# Altium schematic sheet MainAurdino.SchDoc
size 420 x 297 mm; SheetNumber: 1; SheetTotal: 1
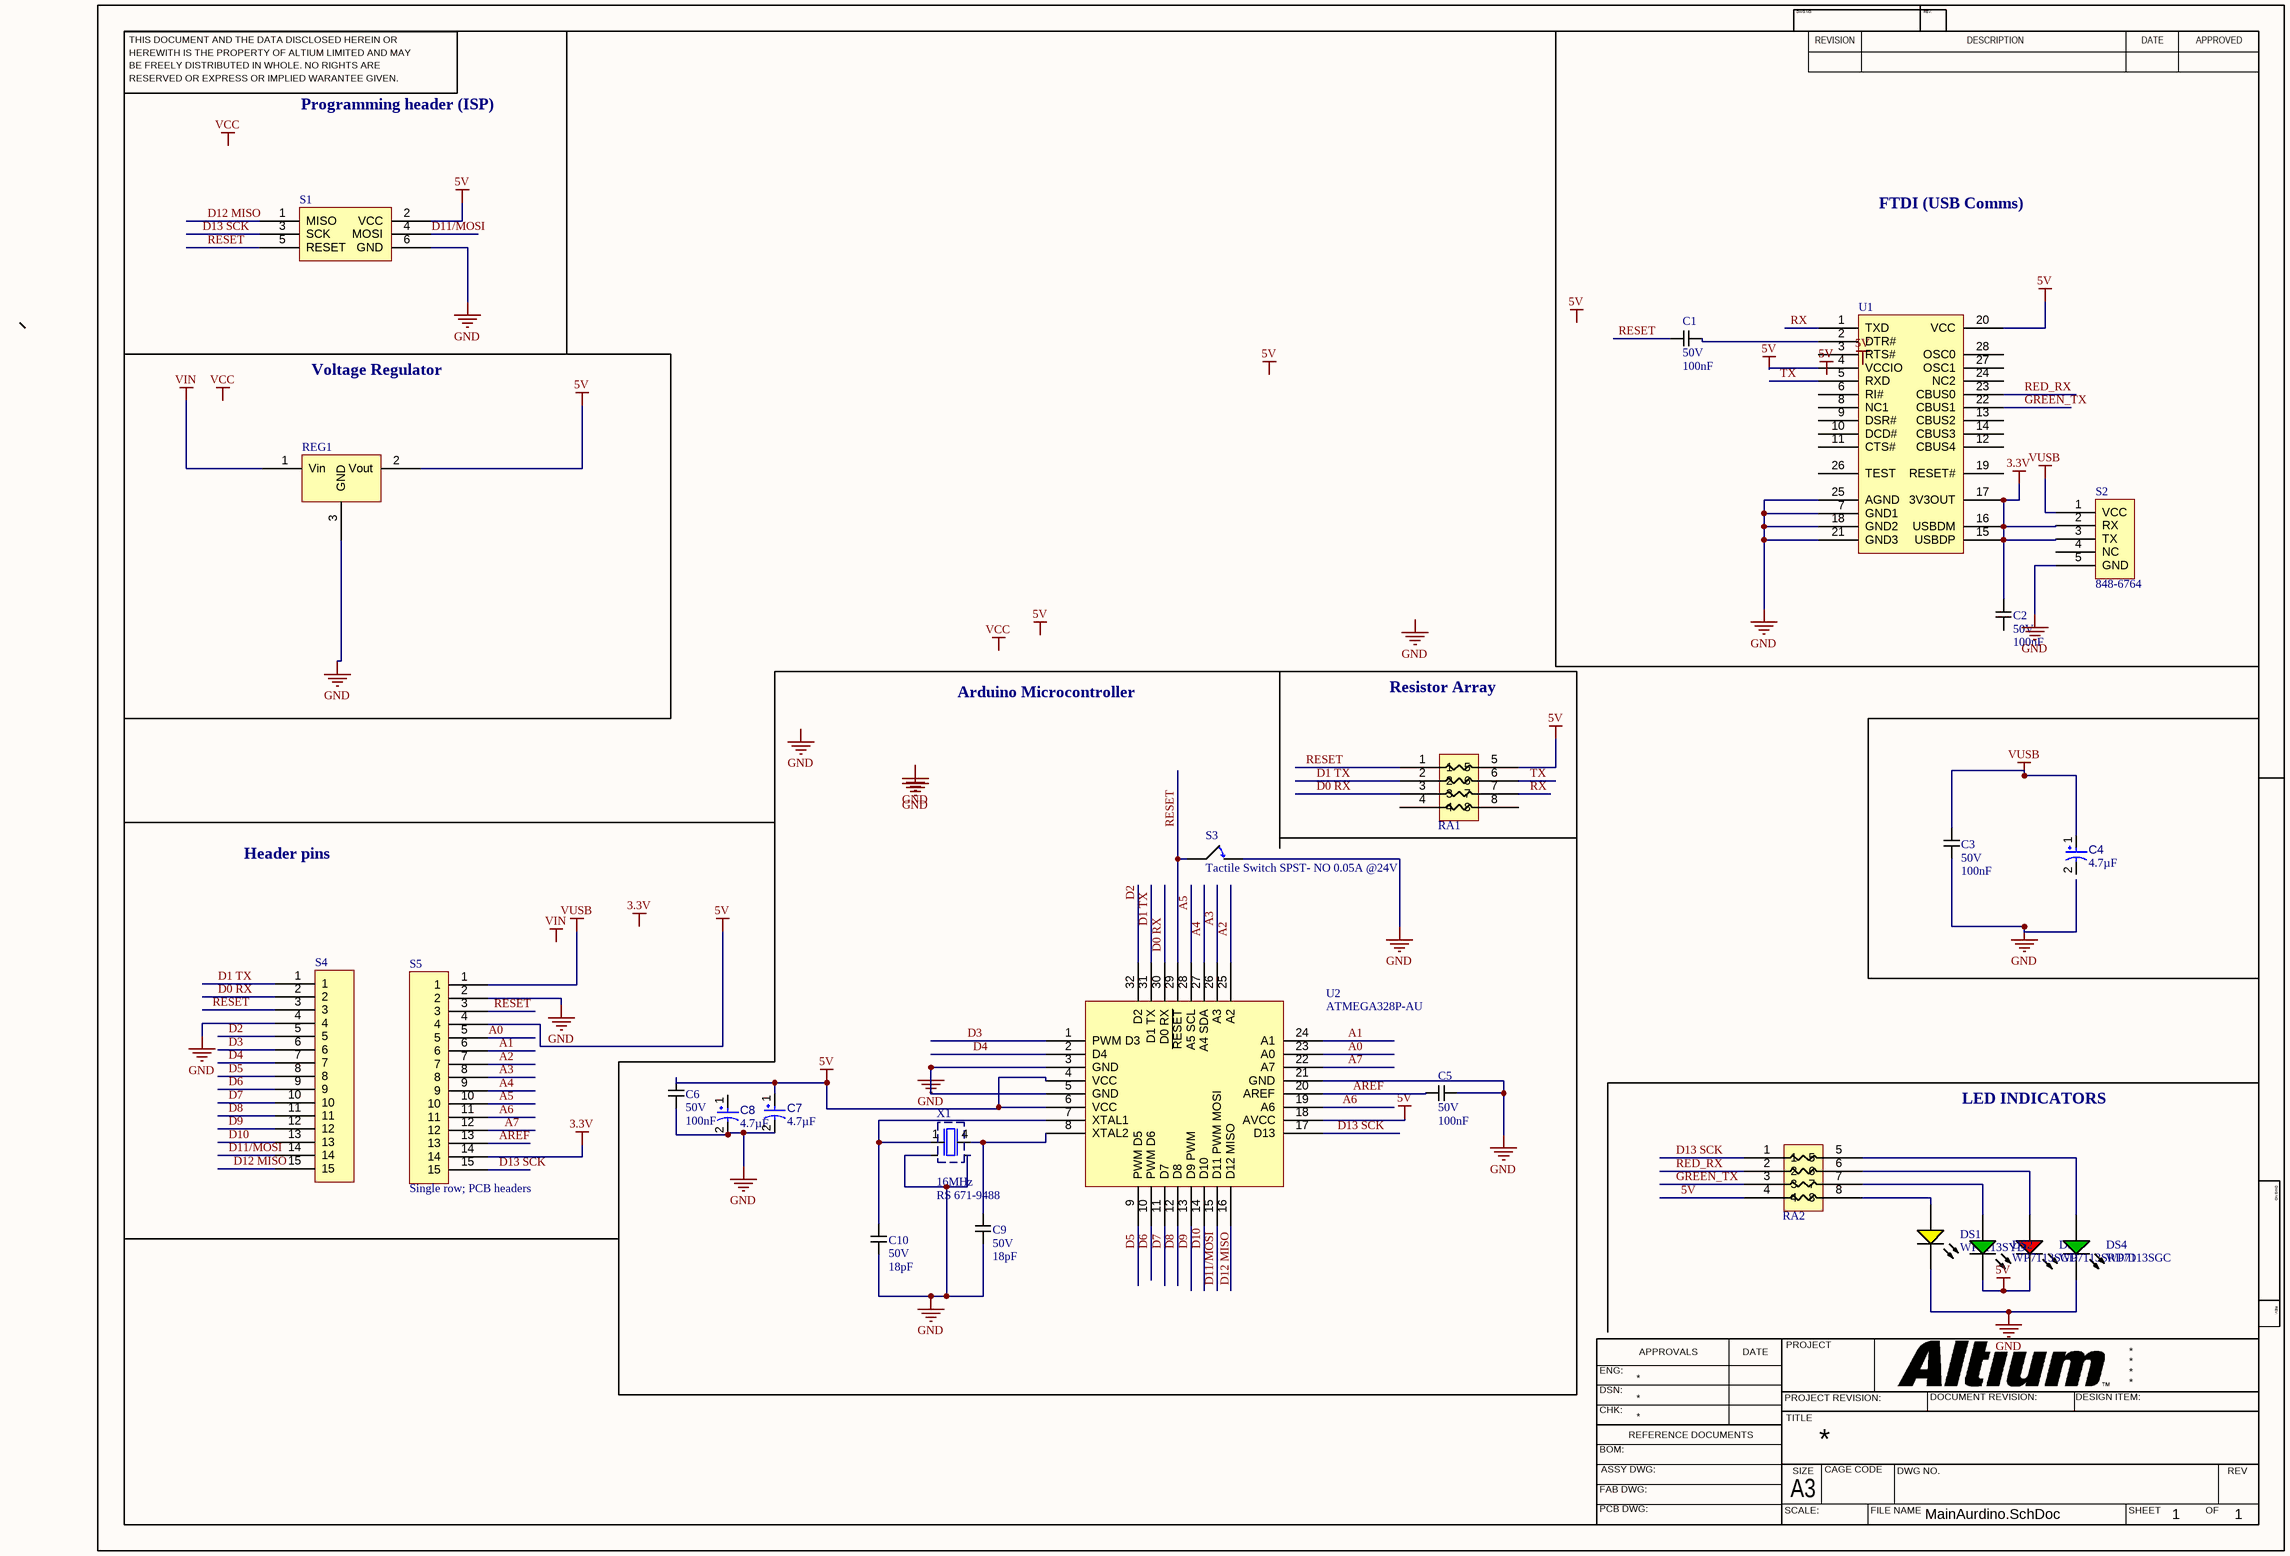
[diagram p0: MainAurdino.SchDoc]

## Parts
C1  Voltage: 50V  Capacitance: 100nF  [CAPCP2012X09N]  (hidden comment: 100nF Ceramic Multilayer Capacitor_1)
C2  Voltage: 50V  Capacitance: 100nF  [CAPCP2012X09N]  (hidden comment: 100nF Ceramic Multilayer Capacitor_1)
C3  Voltage: 50V  Capacitance: 100nF  [CAPCP2012X09N]  (hidden comment: 100nF Ceramic Multilayer Capacitor_1)
C4  value 4.7µF  [AVX-TAJ-A-2_L]  (hidden comment: TAJA475K016RNJ)
C5  Voltage: 50V  Capacitance: 100nF  [CAPCP2012X09N]  (hidden comment: 100nF Ceramic Multilayer Capacitor_1)
C6  Voltage: 50V  Capacitance: 100nF  [CAPCP2012X09N]  (hidden comment: 100nF Ceramic Multilayer Capacitor_1)
C7  value 4.7µF  [AVX-TAJ-A-2_L]  (hidden comment: TAJA475K016RNJ)
C8  value 4.7µF  [AVX-TAJ-A-2_L]  (hidden comment: TAJA475K016RNJ)
C9  Voltage: 50V  Capacitance: 18pF  [CAPCP2012X09N]  (hidden comment: 100nF Ceramic Multilayer Capacitor_1)
C10  Voltage: 50V  Capacitance: 18pF  [CAPCP2012X09N]  (hidden comment: 100nF Ceramic Multilayer Capacitor_1)
DS1  WP7113SYD  [KING-WP7113SYD_V]
DS2  WP7113SGD  [KING-WP7113SGD_V]
DS3  WP7113SRD/D  [KING-WP7113SRDD_V]
DS4  WP7113SGC  [KING-WP7113SGC_V]
RA1  1k +- 5% SMT Resistor Array  [1206 RA]  (value not drawn)
RA2  680 +- 5% SMT Resistor Array 4 Res 1206  [1206 RA]  (value not drawn)
REG1  LM1117MP-5.0  [SOT230P700X180-4N]  (value not drawn)
S1  Programming ISP, Programming Headers Dual Row  [ISP HEADER]  (value not drawn)
S2  RS Stock No: 848-6764  [MicroUSB]  (hidden comment: Micro USB Connector, 30 V ac, 1.8A)
S3  Tactile Switch SPST- NO 0.05A @24V  [Tactile Switch]
S4  Single row; PCB headers  [Header]  (value not drawn)
S5  Single row; PCB headers  [Header]
U1  FT232RL USB to UART, Universal Asynchronous Receiver & Transmitter 3MBd, 28-Pin, SSOP  [SOP65P780X200-28N]  (value not drawn)
U2  ATMEGA328P-AU  [TQFP80P900X900X120-32N]
X1  value 16MHz  RS: RS 671-9488  [Aker S5C Crystal]  (hidden comment: Aker  C5S-16.000-12-3030-X)

## Nets
3.3V: C2.2 S2.2(RX) S2.3(TX) S5.14 U1.15(USBDP) U1.16(USBDM) U1.17(3V3OUT)
5V: C6.2 C7.1 DS2.2(K) DS3.2(K) RA1.5 RA2.4 REG1.2(Vout) S1.2(VCC) S5.4 U1.4(VCCIO) U1.20(VCC) U2.4(VCC) U2.6(VCC) U2.18(AVCC)
GND: C3.1 C5.2 C6.1 C7.2 C8.2 C9.1 C10.1 DS1.2(K) DS4.2(K) REG1.3(GND) S1.6(GND) S2.5(GND) S3.1 S4.4 S5.2 U1.7(GND1) U1.18(GND2) U1.21(GND3) U1.25(AGND) U2.3(GND) U2.5(GND) U2.21(GND) X1.2(Gnd) X1.3(Gnd)
VIN: REG1.1(Vin)
VUSB: C3.2 C4.1 S2.1(VCC) S5.1
A0: S5.5 U2.23(A0)
A1: S5.6 U2.24(A1)
A2: S5.7 U2.25(A2)
A3: S5.8 U2.26(A3)
A4: S5.9 U2.27(A4_SDA)
A5: S5.10 U2.28(A5_SCL)
A6: S5.11 U2.19(A6)
A7: S5.12 U2.22(A7)
AREF: C5.1 S5.13 U2.20(AREF)
D0 RX: RA1.3 S4.2 U2.30(D0_RX)
D1 TX: RA1.2 S4.1 U2.31(D1_TX)
D2: S4.5 U2.32(D2)
D3: S4.6 U2.1(PWM_D3)
D4: S4.7 U2.2(D4)
D5: S4.8 U2.9(PWM_D5)
D6: S4.9 U2.10(PWM_D6)
D7: S4.10 U2.11(D7)
D8: S4.11 U2.12(D8)
D9: S4.12 U2.13(D9_PWM)
D10: S4.13 U2.14(D10)
D11/MOSI: S1.4(MOSI) S4.14 U2.15(D11_PWM_MOSI)
D12 MISO: S1.1(MISO) S4.15
D13 SCK: RA2.1 S1.3(SCK) S5.15 U2.17(D13)
GREEN_TX: RA2.3 U1.22(CBUS1)
RED_RX: RA2.2 U1.23(CBUS0)
RESET: C1.2 RA1.1 S1.5(RESET) S3.1 S4.3 S5.3 U2.29(~{RESET})
RX: RA1.7 U1.1(TXD)
TX: RA1.6 U1.5(RXD)
NetC1_1: C1.1 U1.2(DTR#)
NetC9_2: C9.2 U2.8(XTAL2) X1.4
NetC10_2: C10.2 U2.7(XTAL1) X1.1
NetDS1_1: DS1.1(A) RA2.8
NetDS2_1: DS2.1(A) RA2.7
NetDS3_1: DS3.1(A) RA2.6
NetDS4_1: DS4.1(A) RA2.5

Not connected (* = marked no-connect by the designer): C2 1; C4 2; C8 1; RA1 4 8; S2 4(NC); U1 3(RTS#) 6(RI#) 8(NC1) 9(DSR#) 10(DCD#) 11(CTS#) 12(CBUS4) 13(CBUS2) 14(CBUS3) 19(RESET#) 24(NC2) 26(TEST) 27(OSC1) 28(OSC0); U2 16(D12_MISO)

## Notes on the sheet
- Programming header (ISP)
- FTDI (USB Comms)
- Voltage Regulator
- Arduino Microcontroller
- Resistor Array
- Header pins
- LED INDICATORS
- Labels drawn without touching a wire or pin: 3.3V, 5V, D12 MISO, GND, VCC, VIN
- THIS DOCUMENT AND THE DATA DISCLOSED HEREIN OR
- HEREWITH IS THE PROPERTY OF ALTIUM LIMITED AND MAY
- DWG NO:
- REVISION
- REV:
- DESCRIPTION
- DATE
- APPROVED
- BE FREELY DISTRIBUTED IN WHOLE. NO RIGHTS ARE
- RESERVED OR EXPRESS OR IMPLIED WARANTEE GIVEN.
- ENG:
- APPROVALS
- PROJECT
- DSN:
- CHK:
- REFERENCE DOCUMENTS
- PROJECT REVISION:
- TITLE
- DOCUMENT REVISION:
- DESIGN ITEM:
- BOM:
- FAB DWG:
- PCB DWG:
- ASSY DWG:
- SCALE:
- A3
- SIZE
- CAGE CODE
- FILE NAME
- DWG NO.
- SHEET
- OF
- REV

## Library data of the parts
C1-C3 C5 C6 = CMP-017-000000-1: AVX 0805 Standard 100nF Ceramic Multilayer Capacitor, 50 V dc X7R Dielectric �10% SMD; Component Type: Standard; Package: 0805; Datasheet URL: http://za.rs-online.com/web/p/ceramic-multilayer-capacitors/4646688/; Source: RS Components - Capacitors.SchLib; Creator: Ritesh Kanjee; Manufacturer: AVX; RS Stock No.: 464-6688; Design Item ID: 100nF Ceramic Multilayer Capacitor_1; Date Created: 18 February 2015; Pin Count: 2; Value: 100nF
C4 C7 C8 = CMP-001-00042-7: Standard Tantalum, 4.7 uF, +/- 10%, 16 V, -55 to 125 degC, 1206 (3216 Metric), RoHS, Tape and Reel; Manufacturer: AVX; Resistance: 4Ohm; Voltage Rating: 16V; Manufacturer URL: http://www.avx.com/; Pins: 2; Max Operating Temperature: 125°C; Case/Package: 1206; Package Description: 2-Pin Surface Mount Device, Body 3.2 x 1.65 mm; Datasheet URL: http://datasheets.avx.com/TAJ.pdf; Min Operating Temperature: -55°C; RoHS Compliant: True; Package Reference: TAJ-A-2; ESR: 4Ohm; Capacitor Type: Tantalum; Packaging: TapeandReel; Datasheet Version: Feb-16; Tolerance: 10%; Mounting Technology: SM; Package Quantity: 2000
C9 = CMP-017-000002-1: AVX 0805 Standard 100nF Ceramic Multilayer Capacitor, 50 V dc X7R Dielectric �10% SMD; Value: 18pF; Component Type: Standard; RS Stock No.: 464-6688; Design Item ID: 100nF Ceramic Multilayer Capacitor_1; Manufacturer: AVX; Datasheet URL: http://za.rs-online.com/web/p/ceramic-multilayer-capacitors/4646688/; Pin Count: 2; Source: RS Components - Capacitors.SchLib; Package: 0805; Creator: Ritesh Kanjee; Date Created: 18 February 2015
C10 = CMP-017-000001-1: AVX 0805 Standard 100nF Ceramic Multilayer Capacitor, 50 V dc X7R Dielectric �10% SMD; Value: 18pF; RS Stock No.: 464-6688; Source: RS Components - Capacitors.SchLib; Package: 0805; Design Item ID: 100nF Ceramic Multilayer Capacitor_1; Date Created: 18 February 2015; Manufacturer: AVX; Component Type: Standard; Datasheet URL: http://za.rs-online.com/web/p/ceramic-multilayer-capacitors/4646688/; Creator: Ritesh Kanjee; Pin Count: 2
DS1 = CMP-007-00034-2: The Super Bright Yellow Source Color Device, 2 V, -40 to 85 degC, 2-Pin THD, RoHS, Tape and Reel; Manufacturer: Kingbright; Nominal Vf: 2V; Viewing Angle: 30degrees; Luminous Intensity: 600mcd; Forward Current: 20mA; Lens Style: Diffused; Datasheet Version: Rev. 7B, 01/2015; RoHS Compliant: True; Datasheet URL: http://www.kingbrightusa.com/images/catalog/SPEC/WP7113SYD.pdf; Illumination Colour: Yellow; Package Reference: WP7113SYD; Mounting Technology: TH; Package Quantity: 500; Packaging: Bulk; Package Description: 2-Pin Through Hole Device, Dia 5.9 mm, Body Length 8.6 mm; Case/Package: Radial; Colour: Yellow; Forward Voltage: 2V
DS2 = CMP-007-00010-2: LED Green, 62.5 mW, 25 mA, -40 to 85 degC, 2-Pin THD, RoHS, Bulk; Manufacturer: Kingbright; Lens Style: Dome; Nominal Vf: 2.2V; Power: 62.5mW; Luminous Intensity: 40mcd; Viewing Angle: 30degrees; Datasheet URL: http://www.kingbrightusa.com/images/catalog/SPEC/WP7113SGD.pdf; Datasheet Version: Rev. 6B, 01/2015; Illumination Colour: Green; Package Quantity: 1000; Package Description: 2-Pin Through Hole Device, Dia 5.9 mm, Body Length 8.6 mm; Colour: Green; Case/Package: Radial; RoHS Compliant: True; Package Reference: WP7113SGD; Mounting Technology: TH; Packaging: Bulk; Forward Voltage: 2.2V
DS3 = CMP-007-00033-2: The Super Bright Red Source Color Device, 1.85 V, -40 to 85 degC, 2-Pin THD, RoHS, Tape and Reel; Manufacturer: Kingbright; Nominal Vf: 1.85V; Luminous Intensity: 300mcd; Viewing Angle: 30degrees; Lens Style: Diffused; RoHS Compliant: True; Datasheet Version: Rev. 6A, 07/2016; Illumination Colour: Red; Case/Package: Radial; Package Reference: WP7113SRDD; Package Quantity: 500; Datasheet URL: http://www.kingbrightusa.com/images/catalog/SPEC/WP7113SRD-D.pdf; Colour: Red; Packaging: Bulk; Forward Voltage: 1.85V; Mounting Technology: TH; Package Description: 2-Pin Through Hole Device, Dia 5.9 mm, Body Length 8.6 mm
DS4 = CMP-007-00032-2: The Super Bright Green Source Color Device, 2.2 V, -40 to 85 degC, 2-Pin THD, RoHS, Tape and Reel; Manufacturer: Kingbright; Luminous Intensity: 200mcd; Nominal Vf: 2.2V; Viewing Angle: 20degrees; Lens Style: Clear; Mounting Technology: TH; Forward Voltage: 2.2V; Colour: Green; Package Quantity: 1000; Datasheet Version: Rev. 9B, 01/2015; RoHS Compliant: True; Case/Package: Radial; Package Description: 2-Pin Through Hole Device, Dia 5.9 mm, Body Length 8.6 mm; Packaging: Bulk; Illumination Colour: Green; Datasheet URL: http://www.kingbrightusa.com/images/catalog/SPEC/WP7113SGC.pdf; Package Reference: WP7113SGC
RA1 = CMP-024-000002-1: 1k +- 5% SMT Resistor Array 4 Res; Manufacturer: Bourns; Manufacturer Part No.: CAY16-102J4LF; Wattage: 0.25W; Date Created: 25 February 2015; Component Type: Standard; RS Stock No.: 552-5579; Pin Count: 8; Design Item ID: 1k +- 5% SMT Resistor Array; Creator: R Kanjee; Source: Bourns  Resistor Arrays.SchLib
RA2 = CMP-024-000001-1: Manufacturer: Bourns; Manufacturer Part No.: CAY16-681J4LF; Wattage: 0.25W; Date Created: 25 February 2015; Design Item ID: 680 +- 5% SMT Resistor Array 4 Res 1206; Component Type: Standard; Source: Bourns  Resistor Arrays.SchLib; Creator: R Kanjee; RS Stock No.: 552-5579; Pin Count: 8
REG1 = CMP-016-000000-1: LM1117MP-5.0/NOPB, Low Dropout Voltage Regulator, 1.5A, 5 V �1%, 4-Pin SOT-223; Manufacturer: Texas Instruments; Output Voltage: 5V; Supply Current: 1.5Amps; Maximum Input Voltage: 15V; Pin Count: 3; Date Created: 26 February 2015; Design Item ID: LM1117MP-5.0; Created By: R Kanjee; Source: TI Low Dropout Voltage Regulator.SchLib; Datasheet URL: http://za.rs-online.com/web/p/low-dropout-voltage-regulators/5339583/; RS Stock No.: 533-9583; Component Type: Standard
S1 = CMP-018-000000-1: Programming Headers Dual Row; Manufacturer: FCI; Manufacturer Part No.: 68000-236HLF; Current Rating: 3Amps Continuous; Date Created: 1 March 2015; Design Item ID: Programming ISP, Programming Headers Dual Row; Pin Count: 6; Source: PCB Headers.SchLib; Component Type: Standard; RS Stock No.: 2509565626; Created By: R Kanjee
S2 = CMP-021-000000-1: NewMolex Right Angle SMT Female Type B Micro USB Connector, 30 V ac, 1.8A; Manufacturer Part No.: 105017-0001; Manufacturer: Molex; Max Voltage: 30V; Datasheet URL: http://za.rs-online.com/web/p/micro-usb-connectors/8486764/; Max Current: 1.8A; Pin Count: 5; Creator: R Kanjee; Source: Molex Connectors.SchLib; Date Created: 28 February 2015; Design Item ID: Micro USB Connector, 30 V ac, 1.8A; Component Type: Standard
S3 = CMP-020-000005-1: Manufacturer: Omron; Manufacturer Part No.: B3F1000; State: Normaly Open; Pin Count: 2; Component Type: Standard; Date Created: 25 February 2015; Source: Omron Tactile Switches.SchLib; Design Item ID: Tactile Switch SPST- NO 0.05A @24V; Creator: R Kanjee; RS Stock No.: 686-6847
S4 S5 = CMP-018-000001-1: connector;str header;single row;.1 cont centers;.095 tail;gold or gtx;36 contact; Manufacturer: FCI; Manufacturer Part No.: 68000-236HLF; Current Rating: 3Amps Continuous; RS Stock No.: 2509565626; Design Item ID: Single row; PCB headers; Component Type: Standard; Pin Count: 15; Date Created: 1 March 2015; Created By: R Kanjee; Source: PCB Headers.SchLib
U1 = CMP-023-000000-1: FT232RL, Universal Asynchronous Receiver & Transmitter 3MBd, 28-Pin, SSOP; Manufacturer: FTDI Chip; Manufacturer Part No.: FT232RL; Date Created: 03 March 2015; Design Item ID: FT232RL USB to UART, Universal Asynchronous Receiver & Transmitter 3MBd, 28-Pin, SSOP; Component Type: Standard; Source: FTDI RS232toUSB.SchLib; Pin Count: 28; RS Stock No.: 406-580; Creator: R Kanjee
U2 = ATMEGA328P-AU: ATMEGA328P-AU, 8 bit AVR Microcontroller 20MHz 1 kB, 32 kB Flash, 2 kB RAM, I2C 32-Pin TQFP; Company: Lumina Inova; Created By: Ritesh Kanjee; Date Created: 14 February 2015; RS Stock No.: 696-3092; Datasheet URL: http://docs-europe.electrocomponents.com/webdocs/0db4/0900766b80db4deb.pdf
X1 = CMP-026-000000-1: Aker S5C SMT Crystal; Frequency Stability: +/-30ppm; Load Capacitance: 12pF; RS Stock Nr.: 671-9488; Pin Count: 4; Source: Aker Crystals.SchLib; Component Type: Standard; Design Item ID: Aker  C5S-16.000-12-3030-X; Manufacturer Part #: C5S-16.000-12-3030-X; HelpURL: http://za.rs-online.com/web/p/crystal-units/6719488/; Manufacturer: Aker; Package: 3.2x5mm SMD; Creator: R Kanjee